# EAGLE design alarm_clock (EAGLE 9.6.2)
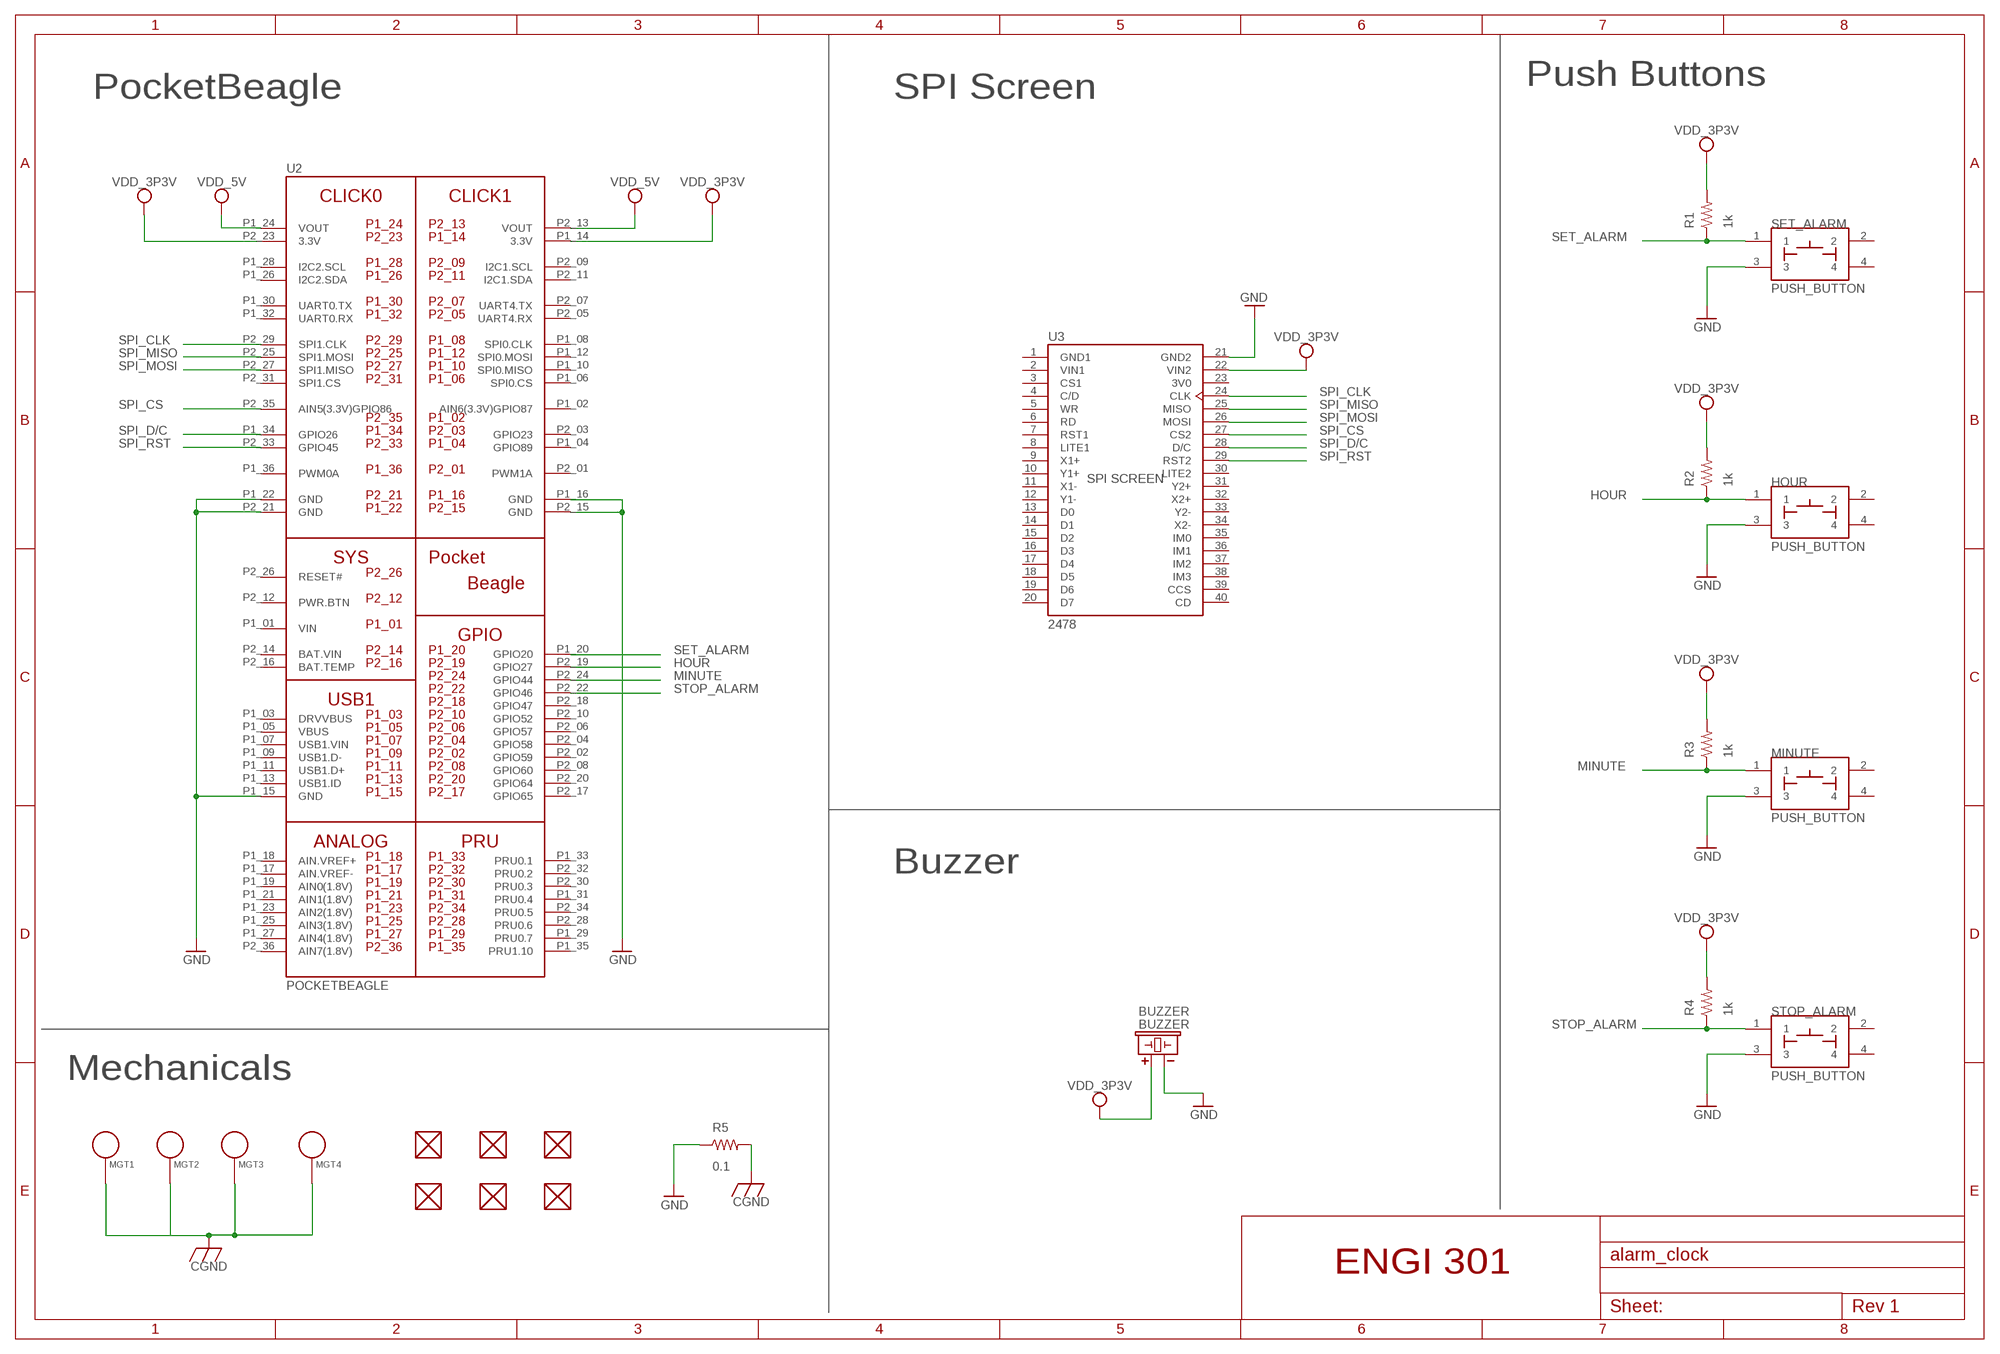
[diagram p0: schematic, sheet 1]

## Parts
BUZZER  BUZZER  [BUZZER_6.5MM]
FUD1  FIDUCIAL  [FIDUCIAL_40MIL]
FUD2  FIDUCIAL  [FIDUCIAL_40MIL]
FUD3  FIDUCIAL  [FIDUCIAL_40MIL]
FUD4  FIDUCIAL  [FIDUCIAL_40MIL]
FUD5  FIDUCIAL  [FIDUCIAL_40MIL]
FUD6  FIDUCIAL  [FIDUCIAL_40MIL]
HOUR  PUSH_BUTTON  [BUTTON_12.5MM]
MGT1  MOUNTING_HOLE  [MOUNTING_HOLE]
MGT2  MOUNTING_HOLE  [MOUNTING_HOLE]
MGT3  MOUNTING_HOLE  [MOUNTING_HOLE]
MGT4  MOUNTING_HOLE  [MOUNTING_HOLE]
MINUTE  PUSH_BUTTON  [BUTTON_12.5MM]
R1  1k  R_R0603  [R0603]
R2  1k  R_R0603  [R0603]
R3  1k  R_R0603  [R0603]
R4  1k  R_R0603  [R0603]
R5  0.1  R_R0402  [R0402]
SET_ALARM  PUSH_BUTTON  [BUTTON_12.5MM]
STOP_ALARM  PUSH_BUTTON  [BUTTON_12.5MM]
U2  POCKETBEAGLE  [POCKETBEAGLE]
U3  2478  [ADAFRUIT_2478]

## Nets
CGND: MGT1.P$1 MGT2.P$1 MGT3.P$1 MGT4.P$1 R5.2
GND: BUZZER.- HOUR.3 MINUTE.3 R5.1 SET_ALARM.3 STOP_ALARM.3 U2.P1_15(GND) U2.P1_16(GND) U2.P1_22(GND) U2.P2_15(GND) U2.P2_21(GND) U3.21(GND2)
HOUR: HOUR.1 R2.1 U2.P2_19(GPIO27)
MINUTE: MINUTE.1 R3.1 U2.P2_24(GPIO44)
SET_ALARM: R1.1 SET_ALARM.1 U2.P1_20(GPIO20)
SPI_CLK: U2.P2_29(SPI1.CLK) U3.24(CLK)
SPI_CS: U2.P2_35(AIN5(3.3V)GPIO86) U3.27(CS2)
SPI_D/C: U2.P1_34(GPIO26) U3.28(D/C)
SPI_MISO: U2.P2_25(SPI1.MOSI) U3.25(MISO)
SPI_MOSI: U2.P2_27(SPI1.MISO) U3.26(MOSI)
SPI_RST: U2.P2_33(GPIO45) U3.29(RST2)
STOP_ALARM: R4.1 STOP_ALARM.1 U2.P2_22(GPIO46)
VDD_3P3V: BUZZER.+ R1.2 R2.2 R3.2 R4.2 U2.P1_14(3.3V) U2.P2_23(3.3V) U3.22(VIN2)
VDD_5V: U2.P1_24(VOUT) U2.P2_13(VOUT)
Unconnected: FUD1.P$1 FUD2.P$1 FUD3.P$1 FUD4.P$1 FUD5.P$1 FUD6.P$1 HOUR.2 HOUR.4 MINUTE.2 MINUTE.4 SET_ALARM.2 SET_ALARM.4 STOP_ALARM.2 STOP_ALARM.4 U2.P1_02(AIN6(3.3V)GPIO87) U2.P1_03(DRVVBUS) U2.P1_04(GPIO89) U2.P1_05(VBUS) U2.P1_06(SPI0.CS) U2.P1_07(USB1.VIN) U2.P1_08(SPI0.CLK) U2.P1_09(USB1.D-) U2.P1_10(SPI0.MISO) U2.P1_11(USB1.D+) U2.P1_12(SPI0.MOSI) U2.P1_13(USB1.ID) U2.P1_17(AIN.VREF-) U2.P1_18(AIN.VREF+) U2.P1_19(AIN0(1.8V)) U2.P1_21(AIN1(1.8V)) U2.P1_23(AIN2(1.8V)) U2.P1_25(AIN3(1.8V)) U2.P1_26(I2C2.SDA) U2.P1_27(AIN4(1.8V)) U2.P1_28(I2C2.SCL) U2.P1_29(PRU0.7) U2.P1_30(UART0.TX) U2.P1_31(PRU0.4) U2.P1_32(UART0.RX) U2.P1_33(PRU0.1) U2.P1_35(PRU1.10) U2.P1_36(PWM0A) U2.P2_01(PWM1A) U2.P2_02(GPIO59) U2.P2_03(GPIO23) U2.P2_04(GPIO58) U2.P2_05(UART4.RX) U2.P2_06(GPIO57) U2.P2_07(UART4.TX) U2.P2_08(GPIO60) U2.P2_09(I2C1.SCL) U2.P2_10(GPIO52) U2.P2_11(I2C1.SDA) U2.P2_12(PWR.BTN) U2.P2_16(BAT.TEMP) U2.P2_17(GPIO65) U2.P2_18(GPIO47) U2.P2_20(GPIO64) U2.P2_26(RESET#) U2.P2_28(PRU0.6) U2.P2_30(PRU0.3) U2.P2_31(SPI1.CS) U2.P2_32(PRU0.2) U2.P2_34(PRU0.5) U2.P2_36(AIN7(1.8V)) U3.3(CS1) U3.4(C/D) U3.5(WR) U3.6(RD) U3.7(RST1) U3.8(LITE1) U3.9(X1+) U3.10(Y1+) U3.11(X1-) U3.12(Y1-) U3.13(D0) U3.14(D1) U3.15(D2) U3.16(D3) U3.17(D4) U3.18(D5) U3.19(D6) U3.20(D7) U3.23(3V0) U3.30(LITE2) U3.31(Y2+) U3.32(X2+) U3.33(Y2-) U3.34(X2-) U3.35(IM0) U3.36(IM1) U3.37(IM2) U3.38(IM3) U3.39(CCS) U3.40(CD)

## Notes on the sheet
- Push Buttons
- PocketBeagle | SPI Screen
- Buzzer
- Mechanicals
- ENGI 301

## Power pins joined to a net without a drawn wire
BAT.VIN: U2.P2_14(BAT.VIN)
GND1: U3.1(GND1)
VIN: U2.P1_01(VIN)
VIN1: U3.2(VIN1)

## Library data of the parts
BUZZER = combo_lock:BUZZER: CEM-1203 Buzzer
FUD1-FUD6 = alarm_clock:FIDUCIAL
HOUR MINUTE SET_ALARM STOP_ALARM = combo_lock:PUSH_BUTTON
MGT1-MGT4 = alarm_clock:MOUNTING_HOLE: Chassis Mounting Hole w/GND connection ability
R1-R4 = combo_lock:R_: RESISTOR, American symbol
R5 = alarm_clock:R_: RESISTOR, American symbol
U2 = combo_lock:POCKETBEAGLE
U3 = combo_lock:2478: Adafruit 2.4" TFT LCD with Touchscreen Breakout w/MicroSD Socket Check availability <https://pricing.snapeda.com/parts/2478/Adafruit%20Industries/view-part?ref=eda>; AVAILABILITY: In Stock; CHECK_PRICES: https://www.snapeda.com/parts/2478/Adafruit+Industries+LLC/view-part/?ref=eda; DESCRIPTION: Adafruit 2.4 TFT LCD with Touchscreen Breakout w/MicroSD Socket - ILI9341 | Adafruit Industries 2478; MF: Adafruit Industries; MP: 2478; PACKAGE: NON STANDARD Adafruit; PRICE: None; SNAPEDA_LINK: https://www.snapeda.com/parts/2478/Adafruit+Industries+LLC/view-part/?ref=snap

## Board
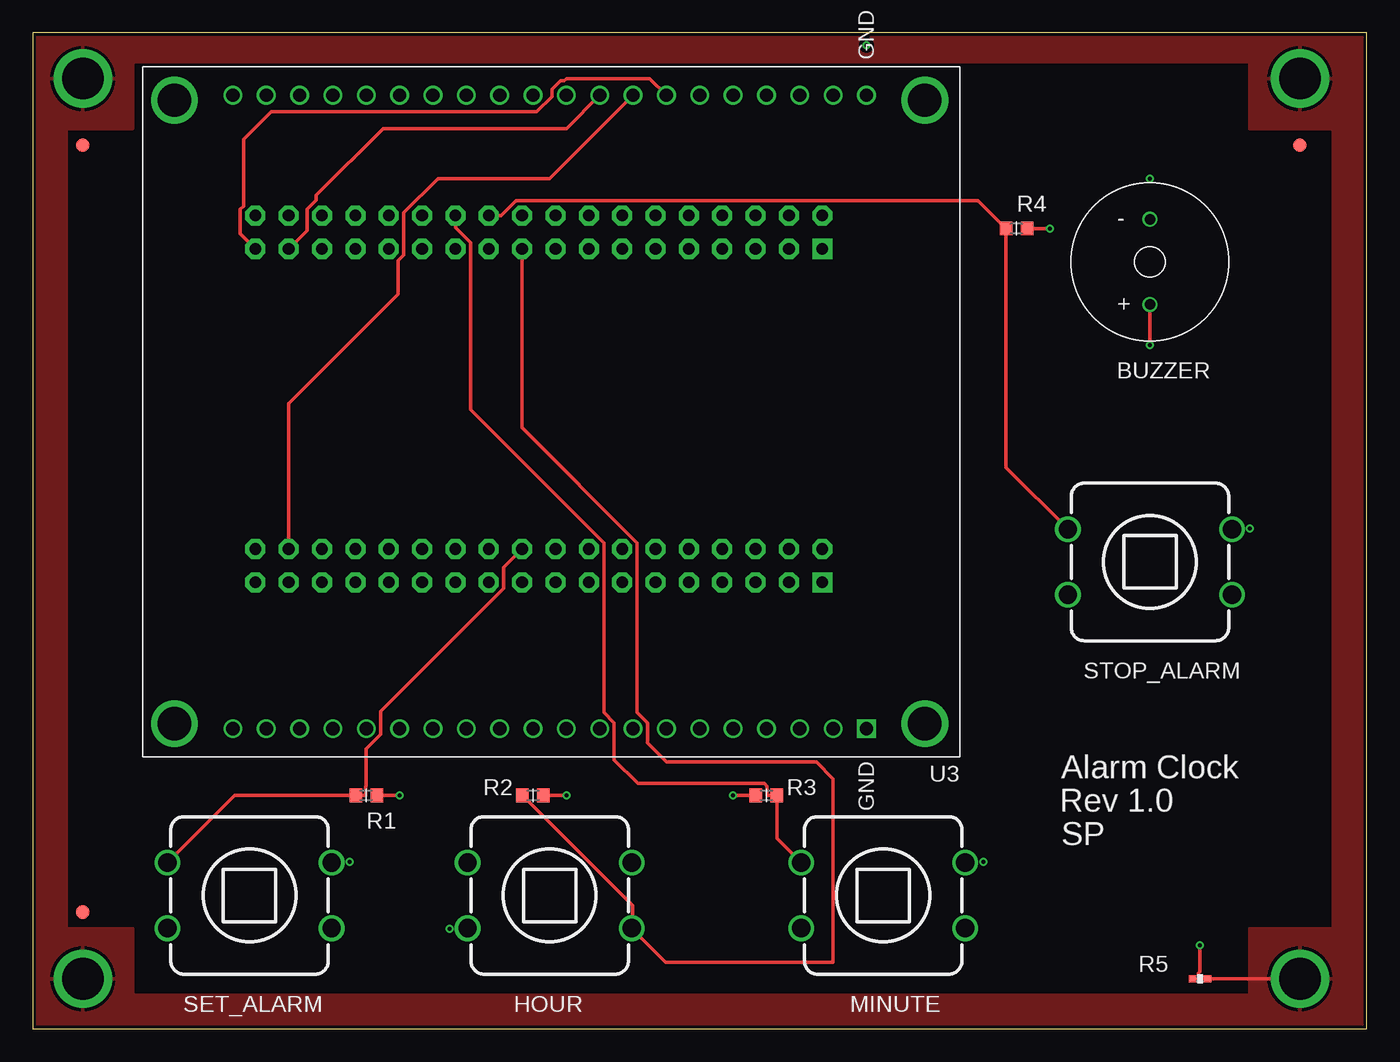
[diagram p1: board, top side]
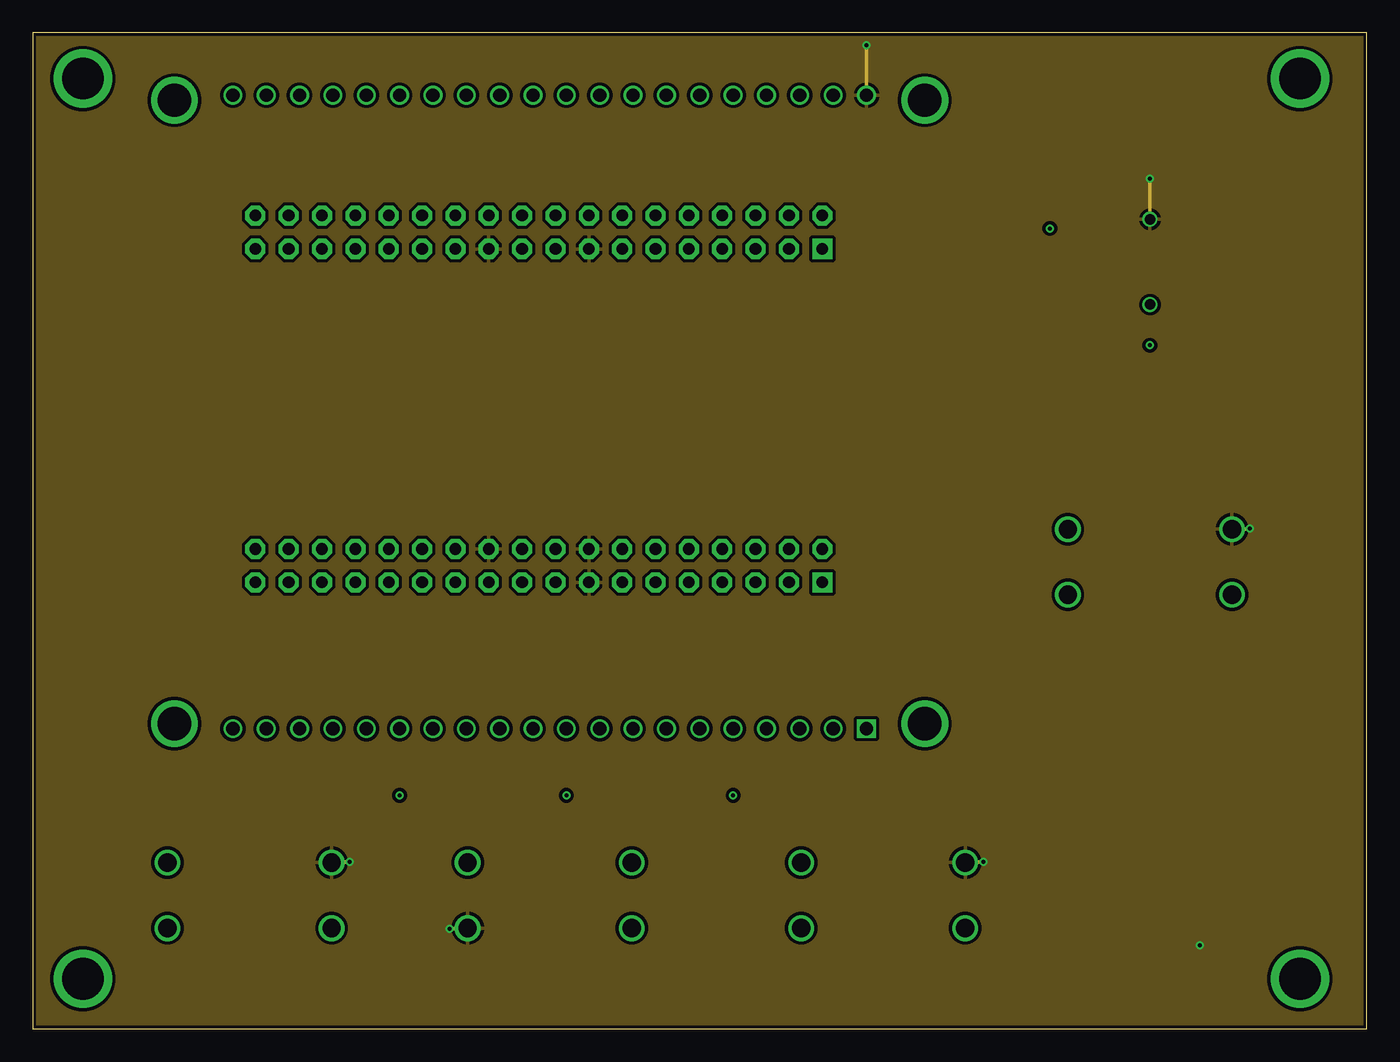
[diagram p2: board, inner layer Route2]
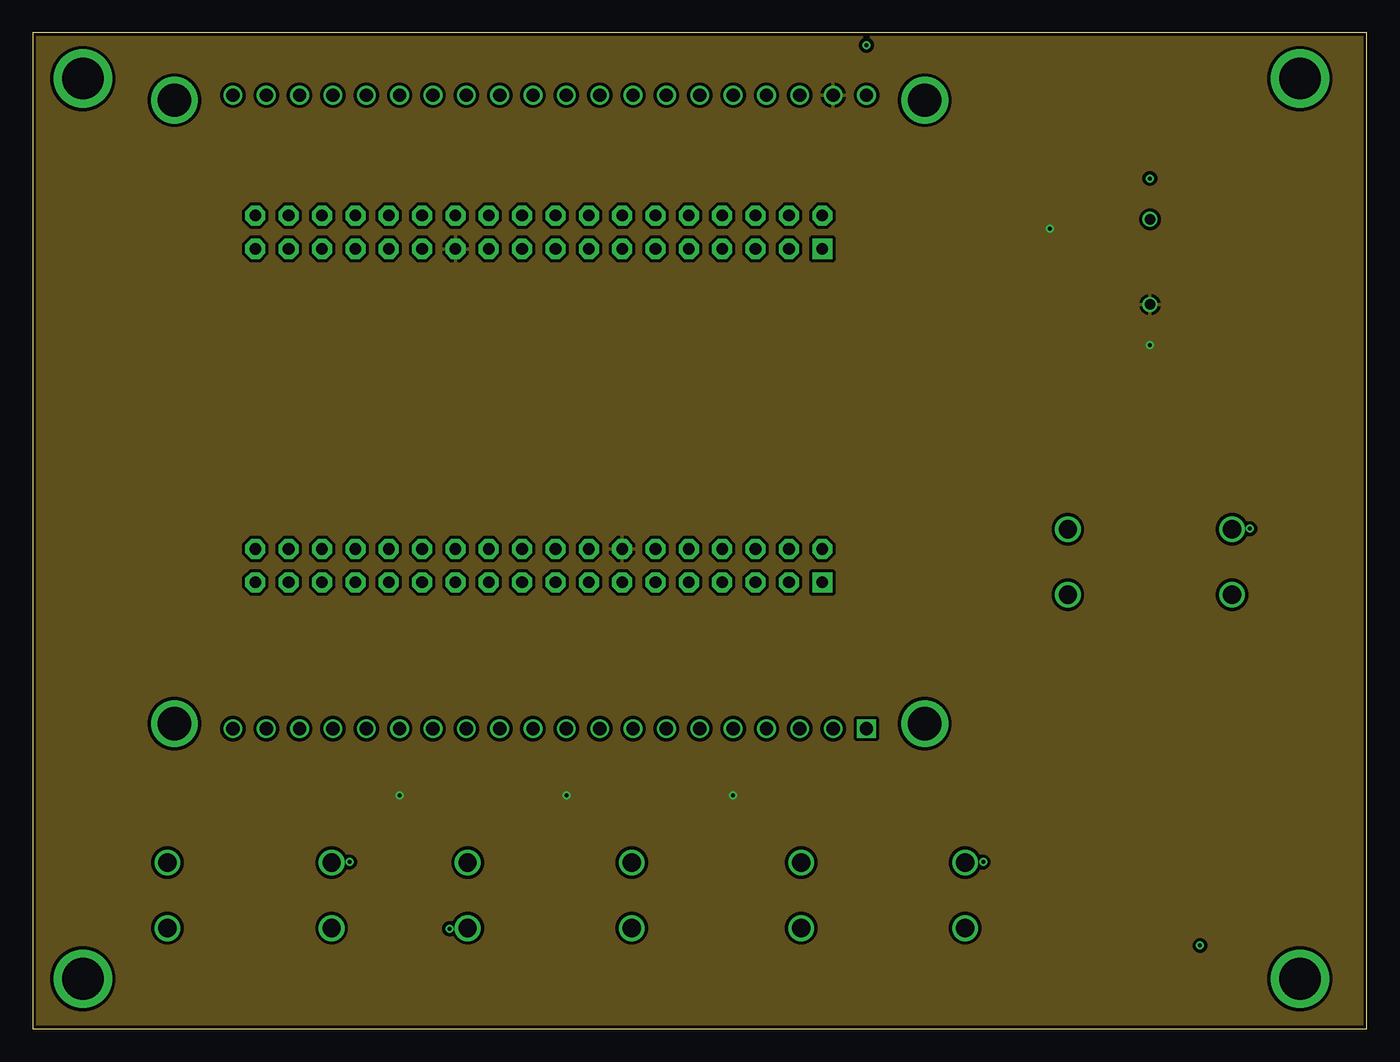
[diagram p3: board, inner layer Route15]
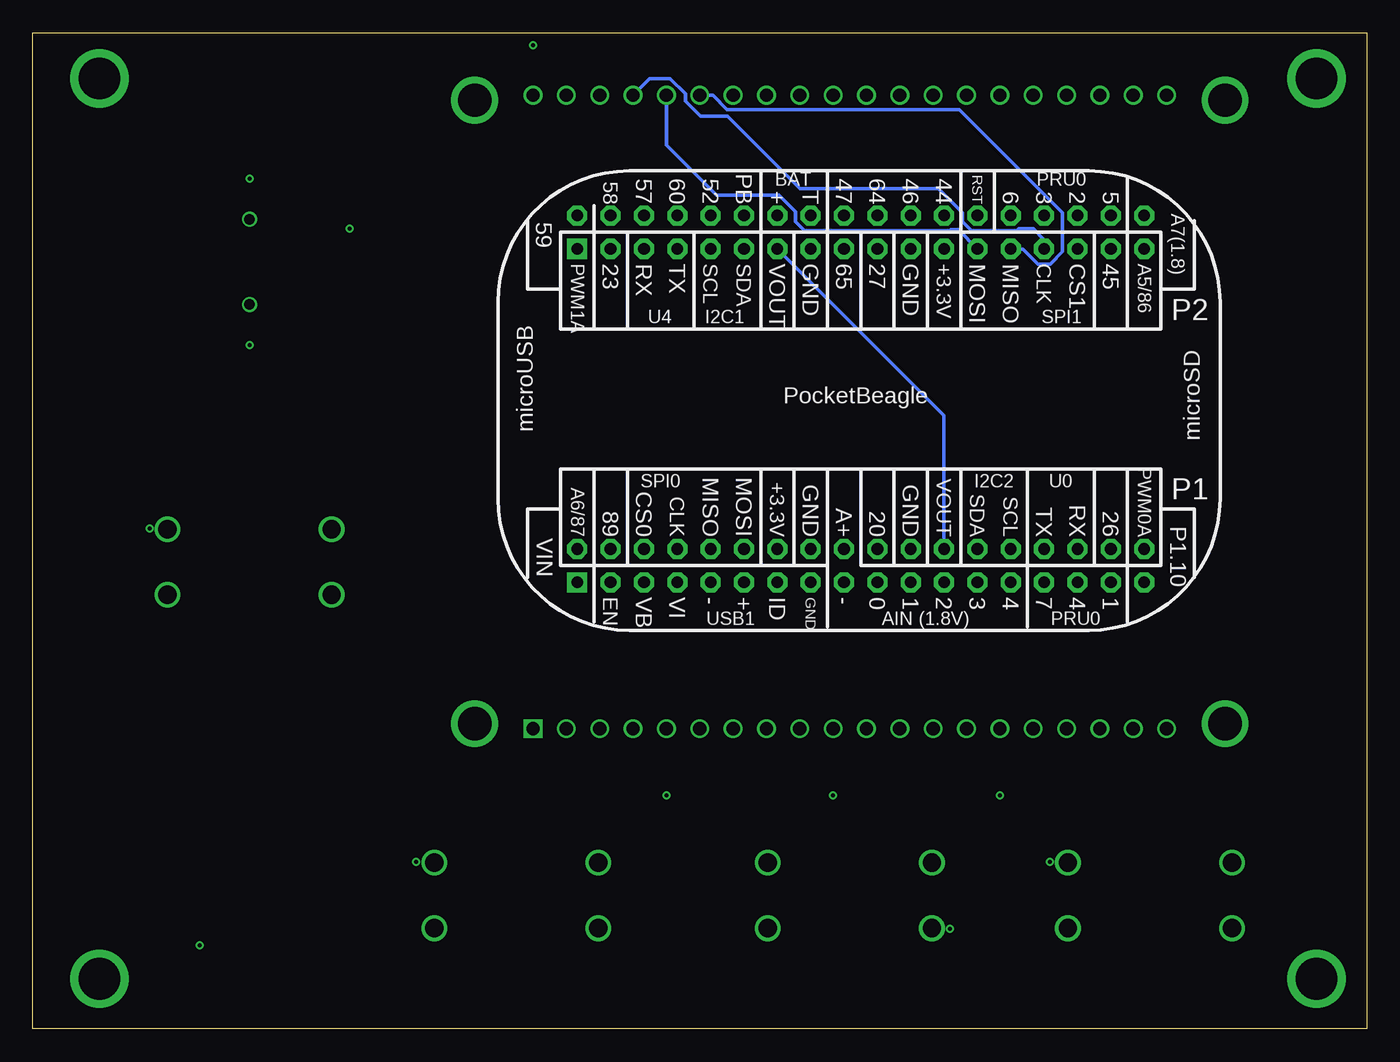
[diagram p4: board, bottom side, seen from below]

Size 101.6 x 75.87 mm. Coordinates in mm from the lower left corner, seen from the top.
Outline: 0,0 101.6,0 101.6,75.87 0,75.87 0,0
Copper layers (1*2*15*16): Top 0.035mm / dielectric 0.23mm / Route2 0.035mm / dielectric 0.93mm / Route15 0.035mm / dielectric 0.23mm / Bottom 0.035mm
Design rules "default *": minimum track width 10mil, minimum drill 12mil, track to track 10mil, track to pad 10mil, pad to pad 10mil, via to via 10mil, smd to smd 10mil, copper to edge 10mil, drill to drill 12mil, minimum pad ring 6mil, minimum via ring 6mil, stop-mask expansion 3mil, vias tented up to drill 25mil, thermal gap 10mil

### Footprints (pad centres in the part's own frame; a part is rotated, then mirrored left to right if it is on the bottom)
BUZZER_6.5MM = drill 0.8: + 0,-3.25; - 0,3.25
FIDUCIAL_40MIL = smd 1.016 x 1.016: P$1 0,0
BUTTON_12.5MM = drill 1.4: 1 -6.25,2.5; 2 -6.25,-2.5; 3 6.25,2.5; 4 6.25,-2.5
MOUNTING_HOLE = drill 3.175 pad 4.445: P$1 0,0
R0603 = smd 0.95 x 1.031: 1 -0.8,0; 2 0.8,0
R0402 = smd 0.61 x 0.508: 1 -0.559,0; 2 0.559,0
POCKETBEAGLE = drill 0.889 pad 1.524 square: P1_01 5.91,3.53; P2_01 5.91,28.93 | drill 0.889 pad 1.524 octagon: P1_02 5.91,6.07; P1_03 8.45,3.53; P1_04 8.45,6.07; P1_05 10.99,3.53; P1_06 10.99,6.07; P1_07 13.53,3.53; P1_08 13.53,6.07; P1_09 16.07,3.53; P1_10 16.07,6.07; P1_11 18.61,3.53; P1_12 18.61,6.07; P1_13 21.15,3.53; P1_14 21.15,6.07; P1_15 23.69,3.53; P1_16 23.69,6.07; P1_17 26.23,3.53; P1_18 26.23,6.07; P1_19 28.77,3.53; P1_20 28.77,6.07; P1_21 31.31,3.53; P1_22 31.31,6.07; P1_23 33.85,3.53; P1_24 33.85,6.07; P1_25 36.39,3.53; P1_26 36.39,6.07; P1_27 38.93,3.53; P1_28 38.93,6.07; P1_29 41.47,3.53; P1_30 41.47,6.07; P1_31 44.01,3.53; P1_32 44.01,6.07; P1_33 46.55,3.53; P1_34 46.55,6.07; P1_35 49.09,3.53; P1_36 49.09,6.07; P2_02 5.91,31.47; P2_03 8.45,28.93; P2_04 8.45,31.47; P2_05 10.99,28.93; P2_06 10.99,31.47; P2_07 13.53,28.93; P2_08 13.53,31.47; P2_09 16.07,28.93; P2_10 16.07,31.47; P2_11 18.61,28.93; P2_12 18.61,31.47; P2_13 21.15,28.93; P2_14 21.15,31.47; P2_15 23.69,28.93; P2_16 23.69,31.47; P2_17 26.23,28.93; P2_18 26.23,31.47; P2_19 28.77,28.93; P2_20 28.77,31.47; P2_21 31.31,28.93; P2_22 31.31,31.47; P2_23 33.85,28.93; P2_24 33.85,31.47; P2_25 36.39,28.93; P2_26 36.39,31.47; P2_27 38.93,28.93; P2_28 38.93,31.47; P2_29 41.47,28.93; P2_30 41.47,31.47; P2_31 44.01,28.93; P2_32 44.01,31.47; P2_33 46.55,28.93; P2_34 46.55,31.47; P2_35 49.09,28.93; P2_36 49.09,31.47
ADAFRUIT_2478 = drill 1.02 square: 1 -24.13,24.13 | drill 1.02: 2 -21.59,24.13; 3 -19.05,24.13; 4 -16.51,24.13; 5 -13.97,24.13; 6 -11.43,24.13; 7 -8.89,24.13; 8 -6.35,24.13; 9 -3.81,24.13; 10 -1.27,24.13; 11 1.27,24.13; 12 3.81,24.13; 13 6.35,24.13; 14 8.89,24.13; 15 11.43,24.13; 16 13.97,24.13; 17 16.51,24.13; 18 19.05,24.13; 19 21.59,24.13; 20 24.13,24.13; 21 -24.13,-24.13; 22 -21.59,-24.13; 23 -19.05,-24.13; 24 -16.51,-24.13; 25 -13.97,-24.13; 26 -11.43,-24.13; 27 -8.89,-24.13; 28 -6.35,-24.13; 29 -3.81,-24.13; 30 -1.27,-24.13; 31 1.27,-24.13; 32 3.81,-24.13; 33 6.35,-24.13; 34 8.89,-24.13; 35 11.43,-24.13; 36 13.97,-24.13; 37 16.51,-24.13; 38 19.05,-24.13; 39 21.59,-24.13; 40 24.13,-24.13 | drill 2.54: S1 -28.575,23.749; S2 -28.575,-23.749; S3 28.575,23.749; S4 28.575,-23.749

### Placement (x,y rotation side)
BUZZER  85.09,58.42 0 top
FUD1  3.81,67.31 0 top
FUD2  3.81,67.31 0 top
FUD3  3.81,8.89 0 top
FUD4  96.52,67.31 0 top
FUD5  3.81,8.89 0 top
FUD6  96.52,67.31 0 top
HOUR  39.37,10.16 180 top
MGT1  3.81,3.81 0 top
MGT2  3.81,72.39 0 top
MGT3  96.52,72.39 0 top
MGT4  96.52,3.81 0 top
MINUTE  64.77,10.16 0 top
R1  25.4,17.78 0 top
R2  38.1,17.78 0 top
R3  55.88,17.78 180 top
R4  74.93,60.96 0 top
R5  88.9,3.81 0 top
SET_ALARM  16.51,10.16 0 top
STOP_ALARM  85.09,35.56 0 top
U2  66.04,30.48 0 bottom
U3  39.37,46.99 180 top

### Tracks (layer width: path | path; a pad name or v marks a point on that pad's centre or on a via)
CGND
  Top 0.254: R5.2 MGT4.P$1
  pour Top: -1.27,38.1 -1.27,-1.27 102.87,-1.27 102.87,39.37 99.06,39.37 99.06,7.62 92.71,7.62 92.71,2.54 7.62,2.54 7.62,7.62 2.54,7.62 2.54,38.1
  pour Top: 102.87,40.64 102.87,77.47 -1.27,77.47 -1.27,38.1 2.54,38.1 2.54,68.58 7.62,68.58 7.62,73.66 92.71,73.66 92.71,68.58 99.06,68.58 99.06,39.37 102.87,39.37
GND  (via drill 0.3 pad 0.61)
  Top 0.254: R5.1 88.77,3.81 88.77,4.22 88.9,4.35 v88.9,6.35
  Route2 0.254: MINUTE.3 71.06,12.7 v72.39,12.7 | HOUR.3 33.08,7.62 v31.75,7.62 | SET_ALARM.3 22.8,12.7 v24.13,12.7 | STOP_ALARM.3 92.67,38.06 v92.71,38.1 | BUZZER.- v85.09,64.77 | v63.5,74.93 U3.21
  pour Route2: 105.41,80.01 105.41,-3.81 -3.81,-3.81 -3.81,80.01
HOUR
  Top 0.254: U2.P2_19 37.27,45.79 46.03,37.02 46.03,24.1 46.81,23.31 46.81,21.77 48.26,20.32 59.69,20.32 60.96,19.05 60.96,5.08 48.2,5.08 45.69,7.59 | 45.69,7.59 HOUR.1 | R2.1 45.69,9.39 45.69,7.59
MINUTE
  Top 0.254: MINUTE.1 56.68,14.5 R3.1 55.94,17.78 55.94,18.45 55.71,18.68 46.09,18.68 44.27,20.5 44.27,23.31 43.49,24.1 43.49,37.02 33.33,47.18 33.33,59.69 33.33,59.88 32.19,61.03 U2.P2_24
SET_ALARM
  Top 0.254: SET_ALARM.1 15.38,17.78 R1.1 25.34,17.78 25.34,18.45 25.4,18.51 25.4,21.31 26.5,22.41 26.5,24.16 35.87,33.54 35.87,35.15 U2.P1_20
SPI_CLK
  Bottom 0.254: U2.P2_29 24.57,60.13 25.4,60.96 26.48,60.96 26.64,60.81 30.12,60.81 30.79,61.48 30.79,62.17 32.63,64.01 43.18,64.01 48.69,69.52 50.75,69.52 51.9,70.67 51.9,71.22 53.06,72.39 54.61,72.39 U3.24
SPI_CS
  Top 0.254: U2.P2_35 15.81,60.55 15.81,62.42 16.06,62.68 16.06,67.76 18.15,69.85 38.38,69.85 39.55,71.02 39.55,71.57 40.19,72.22 40.47,72.22 40.64,72.39 46.99,72.39 U3.27
SPI_D/C
  Top 0.254: U2.P1_34 19.49,47.63 27.84,55.98 27.84,58.52 28.25,58.94 28.25,62.17 30.85,64.77 39.37,64.77 U3.28
SPI_MISO
  Bottom 0.254: U3.25 53.34,67.31 49.53,63.5 44.76,63.5 43.49,62.23 43.49,61.48 43.08,61.06 42.82,60.81 31.72,60.81 31.66,60.87 31.11,60.87 U2.P2_25
SPI_MOSI
  Bottom 0.254: U3.26 49.81,71.12 48.71,70.03 31.03,70.03 23.17,62.17 23.17,59.19 24.1,58.27 25.04,58.27 26.19,59.41 U2.P2_27
SPI_RST
  Top 0.254: U2.P2_33 20.89,60.81 20.89,62.42 21.59,63.13 21.59,63.5 26.67,68.58 40.64,68.58 U3.29
STOP_ALARM
  Top 0.254: U2.P2_22 35.65,61.95 36.8,63.09 72,63.09 R4.1 74.13,42.77 STOP_ALARM.1
VDD_3P3V  (via drill 0.3 pad 0.61)
  Top 0.254: R1.2 v27.94,17.78 | R2.2 v40.64,17.78 | R3.2 v53.34,17.78 | R4.2 v77.47,60.96 | BUZZER.+ v85.09,52.07
  pour Route15: 109.22,83.82 109.22,-7.62 -7.62,-7.62 -7.62,83.82
VDD_5V
  Bottom 0.254: U2.P2_13 32.19,46.71 U2.P1_24

### Text on the board
tNames: Alarm Clock | Rev 1.0 | SP